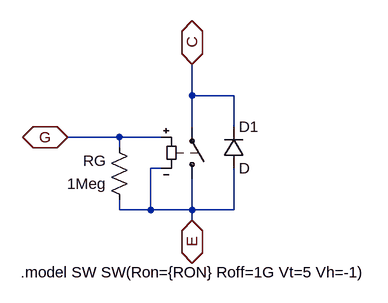
[diagram p0: schematic IGBTg.asc]
IGBTg.asc, the LTspice schematic file:
Version 4
SHEET 1 880 680
WIRE 224 64 224 16
WIRE 288 64 224 64
WIRE 224 112 224 64
WIRE 288 112 288 64
WIRE 112 128 32 128
WIRE 176 128 112 128
WIRE 112 144 112 128
WIRE 176 176 160 176
WIRE 112 240 112 224
WIRE 160 240 160 176
WIRE 160 240 112 240
WIRE 224 240 224 192
WIRE 224 240 160 240
WIRE 288 240 288 176
WIRE 288 240 224 240
WIRE 224 256 224 240
FLAG 224 16 C
IOPIN 224 16 BiDir
FLAG 224 256 E
IOPIN 224 256 BiDir
FLAG 32 128 G
IOPIN 32 128 BiDir
SYMBOL diode 272 176 M180
WINDOW 0 24 64 Left 2
WINDOW 3 24 0 Left 2
SYMATTR InstName D1
SYMBOL sw 224 208 M180
WINDOW 0 24 16 Invisible 2
WINDOW 3 24 96 Invisible 2
SYMATTR InstName S1
SYMBOL res 128 240 R180
WINDOW 0 36 76 Left 2
WINDOW 3 36 40 Left 2
SYMATTR InstName RG
SYMATTR Value 1Meg
TEXT -40 336 Left 2 !.model SW SW(Ron={RON} Roff=1G Vt=5 Vh=-1)

The netlist it stands for:
* IGBTg.asc
D1 E C D
S1 E C G E SW
RG E G 1Meg
.model D D
.lib standard.dio
.model SW SW(Ron={RON} Roff=1G Vt=5 Vh=-1)
.backanno
.end